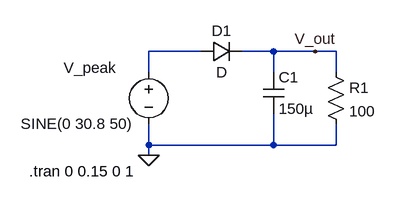
[diagram p0: schematic rectifier.asc]
rectifier.asc, the LTspice schematic file:
Version 4
SHEET 1 880 680
WIRE 144 80 64 80
WIRE 256 80 208 80
WIRE 320 80 256 80
WIRE 352 80 320 80
WIRE 64 112 64 80
WIRE 256 112 256 80
WIRE 352 112 352 80
WIRE 64 224 64 192
WIRE 256 224 256 176
WIRE 256 224 64 224
WIRE 352 224 352 192
WIRE 352 224 256 224
WIRE 64 240 64 224
FLAG 64 240 0
FLAG 320 80 V_out
SYMBOL voltage 64 96 R0
WINDOW 0 -131 9 Left 2
WINDOW 123 0 0 Left 2
WINDOW 39 0 0 Left 2
WINDOW 3 -197 95 Left 2
SYMATTR InstName V_peak
SYMATTR Value SINE(0 30.8 50)
SYMBOL diode 144 96 R270
WINDOW 0 32 32 VTop 2
WINDOW 3 0 32 VBottom 2
SYMATTR InstName D1
SYMBOL cap 240 112 R0
SYMATTR InstName C1
SYMATTR Value 150µ
SYMBOL res 336 96 R0
SYMATTR InstName R1
SYMATTR Value 100
TEXT -120 264 Left 2 !.tran 0 0.15 0 1

The netlist it stands for:
* rectifier.asc
V_peak N001 0 SINE(0 30.8 50)
D1 N001 V_out D
C1 V_out 0 150µ
R1 V_out 0 100
.model D D
.lib standard.dio
.tran 0 0.15 0 1
.backanno
.end